# Altium project MCORD_AFE.PrjPCB (part 1 of 2)
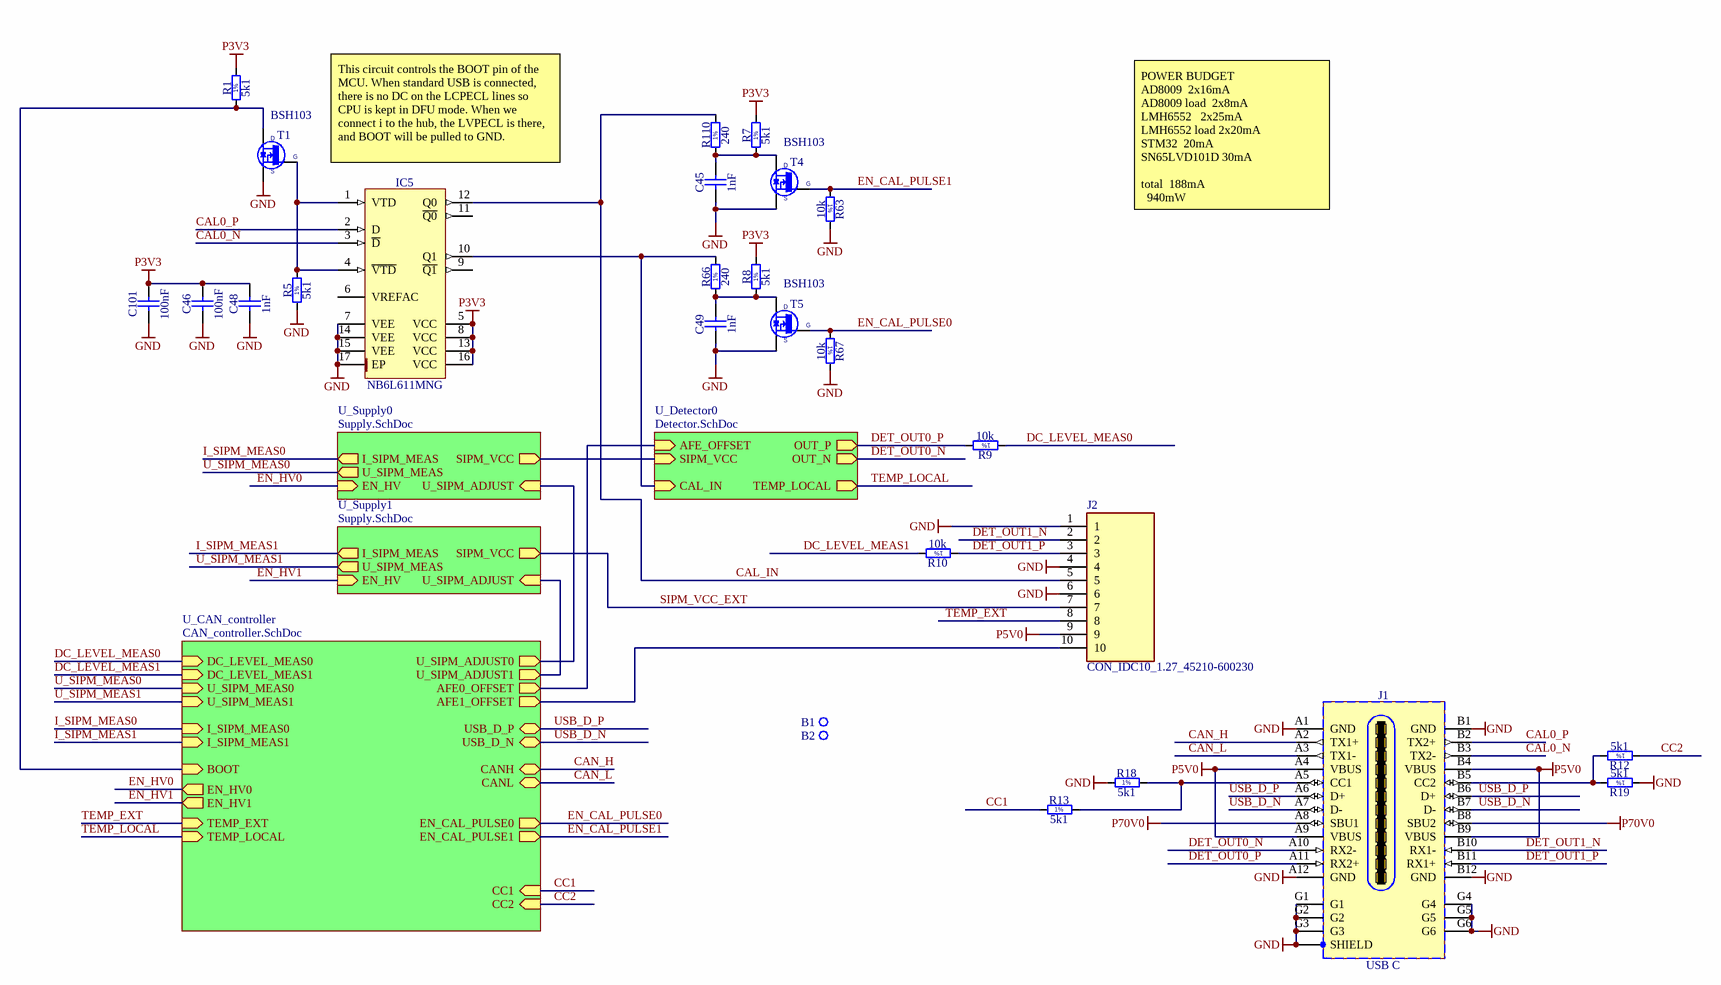
[diagram p0: MCORD_AFE.SchDoc]
4 sheets, 135 parts. Net scope: hierarchical (ports join the sheet entries above them; power ports are global).
Board file: MCORD_AFE.PCBDOC
Sheets:
  MCORD_AFE.SchDoc
    U_CAN_controller = CAN_controller.SchDoc
    U_Detector0 = Detector.SchDoc
    U_Supply0 = Supply.SchDoc
    U_Supply1 = Supply.SchDoc

## Sheet MCORD_AFE.SchDoc: MCORD AFE
size 420 x 297 mm; Author: G.Kasprowicz; CompanyName: WUT ISE; DrawnBy: G.Kasprowicz; Organization: WUT ISE; Address1: PW ISE; Address2: Nowowiejska 15/19 00-665 Warsaw; Address3: gkasprow@gmail.com; DocumentNumber: 1; Revision: 2; SheetNumber: 1; SheetTotal: 4; ModifiedBy: -; CheckedDate: -; Title2: top; DivGrp: WUT ISE; Designer: G.Kasprowicz; ModifiedDate: -; ProjectName: Sensor Box

### Parts
B1  Plated Hole  [MTG320_550]  (value not drawn)  (no BOM)
B2  Plated Hole  [MTG320_550]  (value not drawn)  (no BOM)
C45  1nF  [CAPC1005X55N]
C46  100nF  [CAPC1005X55N]
C48  1nF  [CAPC1005X55N]
C49  1nF  [CAPC1005X55N]
C101  100nF  [CAPC1005X55N]
IC5  NB6L611MNG  [QFN50P300X300X100-17N-S185]
J1  USB C  [AMPHENOL_MUSBRM5C1M0]
J2  CON_IDC10_1.27_45210-600230  [SHDR10W38P127_2X5_1069X594X747P]
R1  5k1  [RESC1005X40N]
R5  5k1  [RESC1005X40N]
R7  5k1  [RESC1005X40N]
R8  5k1  [RESC1005X40N]
R9  10k  [RESC1005X40N]
R10  10k  [RESC1005X40N]
R12  5k1  [RESC1005X40N]
R13  5k1  [RESC1005X40N]
R18  5k1  [RESC1005X40N]
R19  5k1  [RESC1005X40N]
R63  10k  [RESC1005X40N]
R66  240  [RESC1005X40N]
R67  10k  [RESC1005X40N]
R110  240  [RESC1005X40N]
T1  BSH103  [SOT95P230X110-3N]
T4  BSH103  [SOT95P230X110-3N]
T5  BSH103  [SOT95P230X110-3N]

### Sub-sheets
U_CAN_controller = CAN_controller.SchDoc: CANH (bidir), USB_D_P (bidir), CANL (bidir), USB_D_N (bidir), U_SIPM_ADJUST0 (out), U_SIPM_ADJUST1 (out), EN_HV0 (out), EN_HV1 (out), DC_LEVEL_MEAS0 (in), DC_LEVEL_MEAS1 (in), U_SIPM_MEAS0 (in), U_SIPM_MEAS1 (in), I_SIPM_MEAS0 (in), I_SIPM_MEAS1 (in), TEMP_EXT (in), TEMP_LOCAL (in), EN_CAL_PULSE1 (out), EN_CAL_PULSE0 (out), AFE0_OFFSET (out), AFE1_OFFSET (out), BOOT (in), CC2 (in), CC1 (in)
U_Detector0 = Detector.SchDoc: SIPM_VCC (in), OUT_P (out), OUT_N (out), CAL_IN (in), TEMP_LOCAL (out), AFE_OFFSET (in)
U_Supply0 = Supply.SchDoc: SIPM_VCC (out), U_SIPM_MEAS (out), EN_HV (in), I_SIPM_MEAS (out), U_SIPM_ADJUST (in)
U_Supply1 = Supply.SchDoc: SIPM_VCC (out), U_SIPM_MEAS (out), EN_HV (in), I_SIPM_MEAS (out), U_SIPM_ADJUST (in)

### Nets
GND: C45.1 C46.1 C48.1 C49.1 C101.1 IC5.7(VEE) IC5.14(VEE) IC5.15(VEE) IC5.17(EP) J1.A1(GND) J1.A12(GND) J1.B1(GND) J1.B12(GND) J1.G1 J1.G2 J1.G3 J1.G4 J1.G5 J1.G6 J1.SHIELD J2.1 J2.4 J2.6 R5.1 R18.1 R19.1 R63.2 R67.2 T1.2(S) T4.2(S) T5.2(S)
P3V3: C46.2 C48.2 C101.2 IC5.5(VCC) IC5.8(VCC) IC5.13(VCC) IC5.16(VCC) R1.2 R7.2 R8.2
P5V0: J1.A4(VBUS) J1.A9(VBUS) J1.B4(VBUS) J1.B9(VBUS) J2.9
P70V0: J1.A8(SBU1) J1.B8(SBU2)
AFE0_OFFSET: sheet U_CAN_controller/AFE0_OFFSET, sheet U_Detector0/AFE_OFFSET
AFE1_OFFSET: J2.10 ; sheet U_CAN_controller/AFE1_OFFSET
CAL0_N: IC5.3(~{D}) J1.B3(TX2-)
CAL0_P: IC5.2(D) J1.B2(TX2+)
CAL_IN: IC5.12(Q0) J2.5 R110.2
CAN_H: J1.A2(TX1+) ; sheet U_CAN_controller/CANH
CAN_L: J1.A3(TX1-) ; sheet U_CAN_controller/CANL
CC1: R13.1 ; sheet U_CAN_controller/CC1
CC2: R12.1 ; sheet U_CAN_controller/CC2
DC_LEVEL_MEAS0: R9.1 ; sheet U_CAN_controller/DC_LEVEL_MEAS0
DC_LEVEL_MEAS1: R10.2 ; sheet U_CAN_controller/DC_LEVEL_MEAS1
DET_OUT0_N: J1.A10(RX2-) ; sheet U_Detector0/OUT_N
DET_OUT0_P: J1.A11(RX2+) R9.2 ; sheet U_Detector0/OUT_P
DET_OUT1_N: J1.B10(RX1-) J2.2
DET_OUT1_P: J1.B11(RX1+) J2.3 R10.1
EN_CAL_PULSE0: R67.1 T5.1(G) ; sheet U_CAN_controller/EN_CAL_PULSE0
EN_CAL_PULSE1: R63.1 T4.1(G) ; sheet U_CAN_controller/EN_CAL_PULSE1
EN_HV0: sheet U_CAN_controller/EN_HV0, sheet U_Supply0/EN_HV
EN_HV1: sheet U_CAN_controller/EN_HV1, sheet U_Supply1/EN_HV
I_SIPM_MEAS0: sheet U_CAN_controller/I_SIPM_MEAS0, sheet U_Supply0/I_SIPM_MEAS
I_SIPM_MEAS1: sheet U_CAN_controller/I_SIPM_MEAS1, sheet U_Supply1/I_SIPM_MEAS
SIPM_VCC_EXT: J2.7 ; sheet U_Supply1/SIPM_VCC
TEMP_EXT: J2.8 ; sheet U_CAN_controller/TEMP_EXT
TEMP_LOCAL: sheet U_CAN_controller/TEMP_LOCAL, sheet U_Detector0/TEMP_LOCAL
U_SIPM_ADJUST0: sheet U_CAN_controller/U_SIPM_ADJUST0, sheet U_Supply0/U_SIPM_ADJUST
U_SIPM_ADJUST1: sheet U_CAN_controller/U_SIPM_ADJUST1, sheet U_Supply1/U_SIPM_ADJUST
U_SIPM_MEAS0: sheet U_CAN_controller/U_SIPM_MEAS0, sheet U_Supply0/U_SIPM_MEAS
U_SIPM_MEAS1: sheet U_CAN_controller/U_SIPM_MEAS1, sheet U_Supply1/U_SIPM_MEAS
USB_D_N: J1.A7(D-) J1.B7(D-) ; sheet U_CAN_controller/USB_D_N
USB_D_P: J1.A6(D+) J1.B6(D+) ; sheet U_CAN_controller/USB_D_P
NetC45_2: C45.2 R7.1 R110.1 T4.3(D)
NetC49_2: C49.2 R8.1 R66.1 T5.3(D)
NetC99_1: IC5.10(Q1) R66.2 ; sheet U_Detector0/CAL_IN
NetIC5_1: IC5.1(VTD) IC5.4(~{VTD}) R5.2 T1.1(G)
NetJ1_A5: J1.A5(CC1) R13.2 R18.2
NetJ1_B5: J1.B5(CC2) R12.2 R19.2
NetR1_1: R1.1 T1.3(D) ; sheet U_CAN_controller/BOOT
NetR44_2: sheet U_Detector0/SIPM_VCC, sheet U_Supply0/SIPM_VCC

Not connected (* = marked no-connect by the designer): B1 1; B2 1; IC5 6(VREFAC) 9(~{Q1}) 11(~{Q0})

### Notes on the sheet
- This circuit controls the BOOT pin of the MCU. When standard USB is connected, there is no DC on the LCPECL lines so CPU is kept in DFU mode. When we connect i to the hub, the LVPECL is there, and BOOT will be pulled to GND.
- POWER BUDGET
  AD8009		2x16mA
  AD8009 load 	2x8mA
  LMH6552	 	2x25mA
  LMH6552 load	2x20mA
  STM32		20mA
  SN65LVD101D	30mA
  total		188mA
  940mW
- Project/Equipment
- Document
- Designer
- Drawn by
- Check.by
- Copyright WUT ISE 2018.
  This documentation describes Open Hardware and is licensed under the CERN OHL v.1.1. You may redistribute and modify this documentation under the terms of the CERN OHL v.1.1. (http://ohwr.org/CERNOHL). This documentation is distributed WITHOUT ANY EXPRESS OR IMPLIED WARRANTY, INCLUDING OF MERCHANTABILITY, SATISFACTORY QUALITY AND FITNESS FOR A PARTICULAR PURPOSE. Please see the CERN OHL v.1.1 for applicable conditions.
- Contact
- File
- Last Mod.
- Print Date
- Sheet
- Size
- A3
- of
- Rev
- (in symbol R0402_5K1_1%_0.0625W_100PPM) 1%
- (in symbol R0402_10K_1%_0.0625W_100PPM) 1%
- (in symbol R0402_240R_1%_0.0625W_100PPM) 1%

### Library data of the parts
B1 B2 = PLATED_HOLE3.2_PAD5.5: Single Terminal Socket; Part Description: Plated Through Hole: Hole Dia.=3.2mm Pad Dia.=5.5mm; Mounted: No; Part Number: PLATED_HOLE3.2_PAD5.5; Component Type: Standard (No BOM); Pin Count: 1; Family: Plated Hole; Socket: No; SMD: No; Sense: No; Status: None; ComponentHeight: 0mm; HelpURL: Undefined; Author: CERN DEM JMW; CreateDate: 01.10.2012; LatestRevisionDate: 01.10.2012; PackageDescription: Plated Through Hole: Hole Dia.=3.2mm Pad Dia.=5.5mm
C45 C48 C49 = CC0402_1NF_50V_5%_C0G: Non-polarised capacitor; Part Description: SMD Multilayer Chip Ceramic Capacitor; Manufacturer: GENERIC; Manufacturer1 Part Number: C0402C102J5GACTU; Voltage: 50V; TC: C0G/NP0; Tolerance: ±5%; Part Number: CC0402_1NF_50V_5%_C0G; Component Kind: Standard; Component Type: Standard; Pin Count: 2; Value: 1nF; Status: Preferred; Manufacturer Part Number: CC0402_1NF_50V_5%_C0G; Case: 0402; Mounted: Yes; Socket: No; SMD: Yes; Sense: No; Manufacturer1 Example: KEMET; Manufacturer1 ComponentHeight: 0.55mm; HelpURL: \\cern.ch\dfs\Applications\Altium\Datasheets\CC0402_C0G_KEMET_(Commercial Grade).pdf; Author: CERN DEM BC; CreateDate: 02/09/2019; LatestRevisionDate: 02/09/2019
C46 C101 = CC0402_100NF_16V_10%_X7R: Non-polarised capacitor; Part Description: SMD Multilayer Chip Ceramic Capacitor; Manufacturer: GENERIC; Manufacturer1 Part Number: GRM155R71C104KA88D; Voltage: 16V; TC: X7R; Tolerance: ±10%; Part Number: CC0402_100NF_16V_10%_X7R; Component Kind: Standard; Component Type: Standard; Pin Count: 2; Value: 100nF; Status: Not Recommended; Manufacturer Part Number: CC0402_100NF_16V_10%_X7R; Case: 0402; Mounted: Yes; Socket: No; SMD: Yes; Sense: No; HelpURL: \\cern.ch\dfs\Applications\Altium\Datasheets\CC0402_X7R_MURATA_GRM.pdf; Author: CERN DEM JLC; CreateDate: 05.12.2013; LatestRevisionDate: 03.12.2007; Manufacturer1 Example: MURATA; Manufacturer1 ComponentHeight: 0.55mm
IC5 = NB6L611MNG: 2.5V/3.3V 1:2 Differential LVPECL Clock / Data Fanout Buffer; Manufacturer: ON SEMICONDUCTOR; PressFit: No; Bonding: No; Part Number: NB6L611MNG; Component Kind: Standard; Component Type: Standard; Device: NB6L611MNG; PackageDescription: QFN,0.50mm pitch,square; 4 pin X 4 pin, 3mm X 3mm X 1.00mm H body (w/thermal tab 1.85 X 1.85mm),  IPC Medium Density; Part Description: 2.5V/3.3V 1:2 Differential LVPECL Clock / Data Fanout Buffer; Manufacturer Part Number: NB6L611MNG; Pin Count: 17; Case: QFN16; Mounted: Yes; Socket: No; SMD: Yes; Sense: No; ComponentHeight: 1mm; Author: CERN DEM JLC; HelpURL: \\cern.ch\dfs\Applications\Altium\Datasheets\NB6L611MNG.pdf; CreateDate: 21.02.2018; LatestRevisionDate: 21.02.2018
J1 = AMPHENOL_MUSBRM5C1M0: 2x12 Pin + 6G + 1 Shield  USB Type C Receptacle; Part Description: 1 Port Vertical Receptacle 24 Contacts Rugged USB Type C Input Output Connector; PressFit: No; Part Number: AMPHENOL_MUSBRM5C1M0; Component Kind: Standard; Component Type: Standard; Pin Count: 31; Family: USB C; Mounted: Yes; Socket: No; SMD: No; Sense: No; Status: None; Manufacturer: AMPHENOL; Manufacturer Part Number: MUSBRM5C1M0; ComponentHeight: 14.95mm; HelpURL: \\cern.ch\dfs\Applications\Altium\Datasheets\AMPHENOL_MUSBRM5C1M0.pdf; Author: CERN DEM BC; CreateDate: 26/02/2020; LatestRevisionDate: 26/02/2020
J2 = CON_IDC10_1.27_45210-600230: Connector; Manufacturer_Name: 3M; Allied_Number: 70331440; Datasheet Link: http://multimedia.3m.com/mws/media/905148O/3m-shrouded-boardmount-header-452-series-cd2437.pdf; Height: 7.468mm; Manufacturer_Part_Number: 45210-600230; Mouser Part Number: 517-45210-600230; Mouser Price/Stock: https://www.mouser.com/Search/Refine.aspx?Keyword=517-45210-600230; RS Part Number: 8273691; RS Price/Stock: https://uk.rs-online.com/web/p/products/8273691; Allied Price/Stock: https://www.alliedelec.com/3m-45210-600230/70331440/
R1 R5 R7 R8 R12 R13 R18 R19 = R0402_5K1_1%_0.0625W_100PPM: Resistor - 1%; Part Description: General Purpose Thick Film Chip Resistor; Manufacturer: GENERIC; Manufacturer1 Part Number: 232270675102L; TC: ±100ppm/°C; PressFit: No; Part Number: R0402_5K1_1%_0.0625W_100PPM; Component Kind: Standard; Component Type: Standard; Pin Count: 2; Value: 5k1; Status: Not Recommended; Power: 0.0625W; Tolerance: ±1%; Manufacturer Part Number: R0402_5K1_1%_0.0625W_100PPM; Case: 0402; Mounted: Yes; Sense: No; Socket: No; SMD: Yes; Manufacturer1 Example: YAGEO PHYCOMP; Manufacturer1 ComponentHeight: 0.4mm; HelpURL: \\cern.ch\dfs\Applications\Altium\Datasheets\R0402_Phycomp_RC0402.pdf; Author: CERN DEM JLC; CreateDate: 03.12.2007; LatestRevisionDate: 17.10.2012
R9 R10 R63 R67 = R0402_10K_1%_0.0625W_100PPM: Resistor - 1%; Part Description: General Purpose Thick Film Chip Resistor; Manufacturer: GENERIC; Manufacturer1 Part Number: 232270671003L; TC: ±100ppm/°C; PressFit: No; Part Number: R0402_10K_1%_0.0625W_100PPM; Component Kind: Standard; Component Type: Standard; Pin Count: 2; Value: 10k; Status: Not Recommended; Power: 0.0625W; Tolerance: ±1%; Manufacturer Part Number: R0402_10K_1%_0.0625W_100PPM; Case: 0402; Mounted: Yes; Sense: No; Socket: No; SMD: Yes; Manufacturer1 Example: YAGEO PHYCOMP; Manufacturer1 ComponentHeight: 0.4mm; HelpURL: \\cern.ch\dfs\Applications\Altium\Datasheets\R0402_Phycomp_RC0402.pdf; Author: CERN DEM JLC; CreateDate: 03.12.2007; LatestRevisionDate: 17.10.2012
R66 R110 = R0402_240R_1%_0.0625W_100PPM: Resistor - 1%; Part Description: General Purpose Thick Film Chip Resistor; Manufacturer: GENERIC; Manufacturer1 Part Number: 232270672401L; TC: ±100ppm/°C; PressFit: No; Part Number: R0402_240R_1%_0.0625W_100PPM; Component Kind: Standard; Component Type: Standard; Pin Count: 2; Value: 240; Status: Not Recommended; Power: 0.0625W; Tolerance: ±1%; Manufacturer Part Number: R0402_240R_1%_0.0625W_100PPM; Case: 0402; Mounted: Yes; Sense: No; Socket: No; SMD: Yes; Manufacturer1 Example: YAGEO PHYCOMP; Manufacturer1 ComponentHeight: 0.4mm; HelpURL: \\cern.ch\dfs\Applications\Altium\Datasheets\R0402_Phycomp_RC0402.pdf; Author: CERN DEM JLC; CreateDate: 03.12.2007; LatestRevisionDate: 17.10.2012
T1 T4 T5 = BSH103: N-CHANNEL MOSFET WITH DIODE; Part Description: 30V 850mA N-Channel Enhancement Mode Field-Effect Transistor; Manufacturer: NEXPERIA; PressFit: No; Bonding: No; Part Number: BSH103; Component Kind: Standard; Component Type: Standard; Device: BSH103; PackageDescription: SOT23, 3 pin, Pitch 0.95mm - 1.3mm W X 2.9mm L X 1.1mm H, IPC Medium Density; Manufacturer Part Number: BSH103; Pin Count: 3; Case: SOT23-3; Mounted: Yes; Socket: No; SMD: Yes; Sense: No; ComponentHeight: 1.1mm; HelpURL: \\cern.ch\dfs\Applications\Altium\Datasheets\BSH103.pdf; Author: CERN DEM JLC; CreateDate: 16/03/2010; LatestRevisionDate: 20/06/2017

## Sheet CAN_controller.SchDoc: MCORD AFE
size 420 x 297 mm; Author: G.Kasprowicz; CompanyName: WUT ISE; DrawnBy: G.Kasprowicz; Organization: WUT ISE; Address1: PW ISE; Address2: Nowowiejska 15/19 00-665 Warsaw; Address3: gkasprow@gmail.com; DocumentNumber: 3; Revision: 2; SheetNumber: 3; SheetTotal: 4; ModifiedBy: -; CheckedDate: -; Title2: CAN controller; DivGrp: WUT ISE; Designer: G.Kasprowicz; ModifiedDate: -; ProjectName: Sensor Box
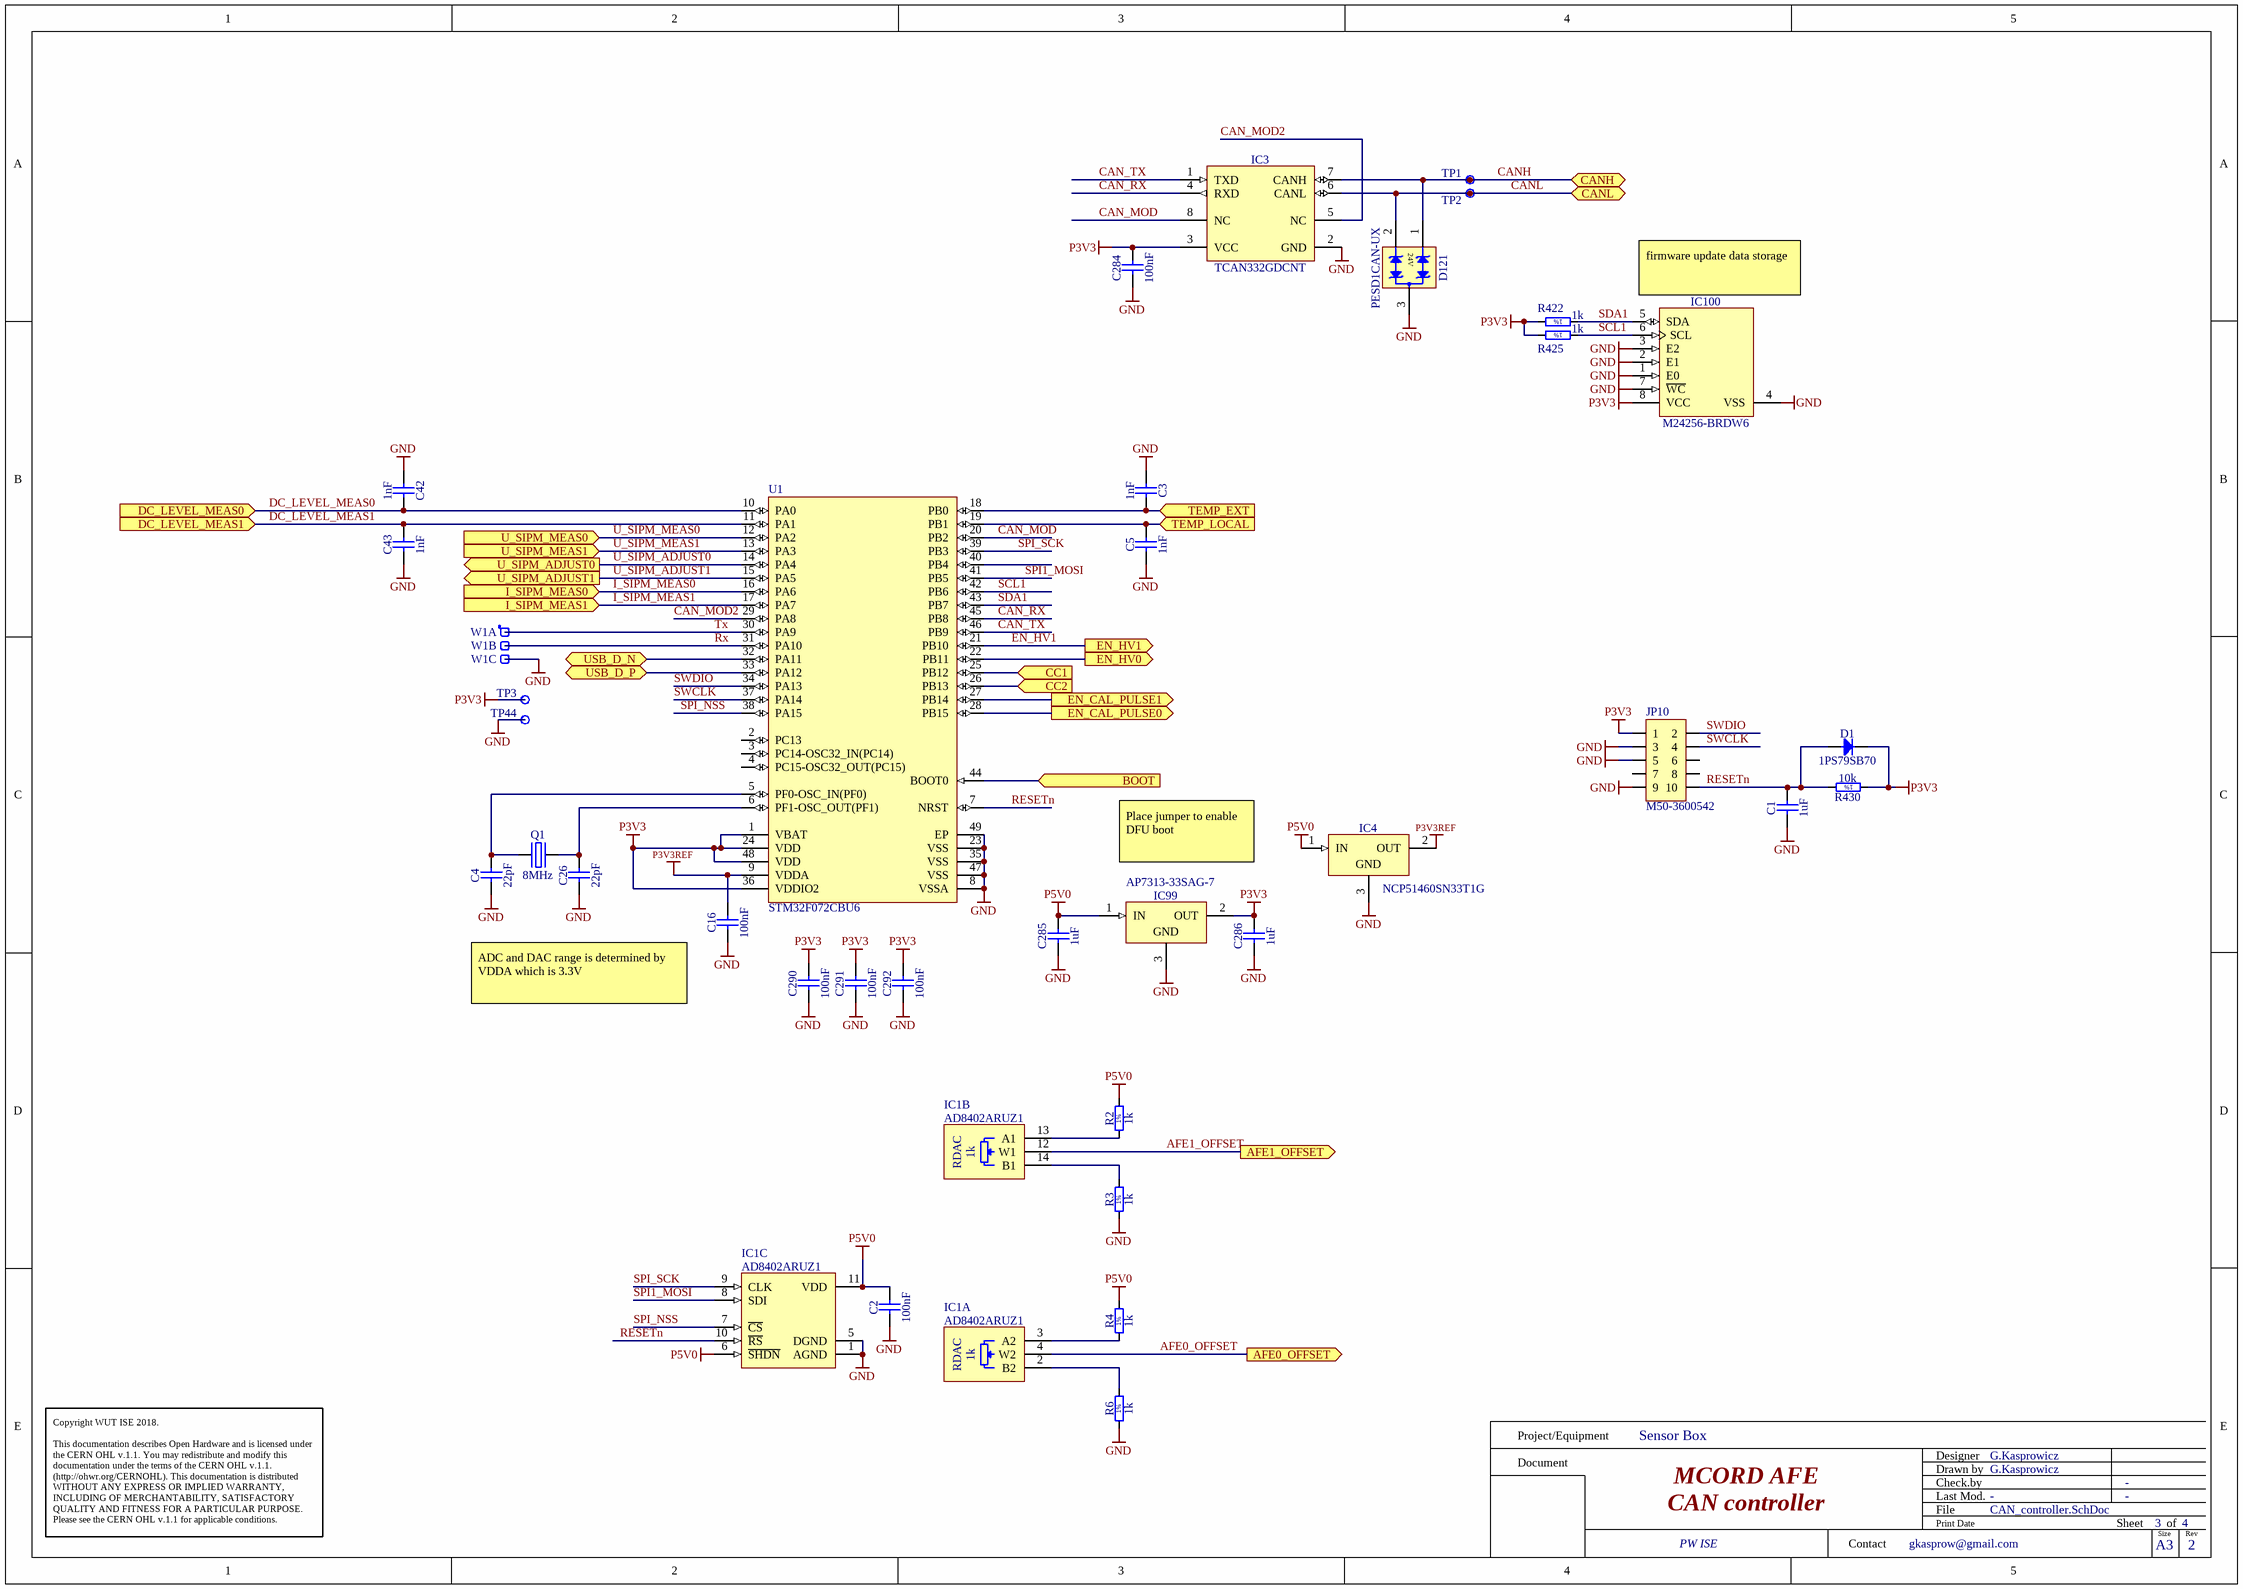
[diagram p1: CAN_controller.SchDoc]

### Parts
C1  1uF  [CAPC1608X87N]
C2  100nF  [CAPC1005X55N]
C3  1nF  [CAPC1005X55N]
C4  22pF  [CAPC1005X55N]
C5  1nF  [CAPC1005X55N]
C16  100nF  [CAPC1005X55N]
C26  22pF  [CAPC1005X55N]
C42  1nF  [CAPC1005X55N]
C43  1nF  [CAPC1005X55N]
C284  100nF  [CAPC1005X55N]
C285  1uF  [CAPC1608X87N]
C286  1uF  [CAPC1608X87N]
C290  100nF  [CAPC1005X55N]
C291  100nF  [CAPC1005X55N]
C292  100nF  [CAPC1005X55N]
D1  1PS79SB70  [SODFL1608X65N]
D121  PESD1CAN-UX  [SOT95P237X112-3N]
IC1  AD8402ARUZ1  [SOP65P640X120-14N]  (parts A,B,C of 3)
IC3  TCAN332GDCNT  [SOT65P280X145-8N]
IC4  NCP51460SN33T1G  [SOT95P240X110-3N]
IC99  AP7313-33SAG-7  [SOT95P240X130-3N]
IC100  M24256-BRDW6  [SOP65P640X120-8N]
JP10  M50-3600542  [PLHTD10S-TR-CV]
Q1  8MHz  [XTAL_TXC_7A]
R2  1k  [RESC1005X40N]
R3  1k  [RESC1005X40N]
R4  1k  [RESC1005X40N]
R6  1k  [RESC1005X40N]
R422  1k  [RESC1005X40N]
R425  1k  [RESC1005X40N]
R430  10k  [RESC1005X40N]
TP1  Test Point  [TPS127]  (value not drawn)
TP2  Test Point  [TPS127]  (value not drawn)
TP3  Test Point  [TPS127]  (value not drawn)
TP44  Test Point  [TPS127]  (value not drawn)
U1  STM32F072CBU6  [STM-UFQFPN48_L]
W1  Header 3  [SAMTEC_HTSW-103-23-L-S]  (value not drawn)  (parts A,B,C of 3)

### Ports
AFE0_OFFSET (out), AFE1_OFFSET (out), BOOT (in), CANH (bidir), CANL (bidir), CC1 (in), CC2 (in), DC_LEVEL_MEAS0 (in), DC_LEVEL_MEAS1 (in), EN_CAL_PULSE0 (out), EN_CAL_PULSE1 (out), EN_HV0 (out), EN_HV1 (out), I_SIPM_MEAS0 (in), I_SIPM_MEAS1 (in), TEMP_EXT (in), TEMP_LOCAL (in), U_SIPM_ADJUST0 (out), U_SIPM_ADJUST1 (out), U_SIPM_MEAS0 (in), U_SIPM_MEAS1 (in), USB_D_N (bidir), USB_D_P (bidir)

### Nets
GND: C1.1 C2.1 C3.1 C4.1 C5.1 C16.1 C26.1 C42.1 C43.1 C284.1 C285.1 C286.1 C290.1 C291.1 C292.1 D121.3(GND) IC1.1(AGND) IC1.5(DGND) IC3.2(GND) IC4.3(GND) IC99.3(GND) IC100.1(E0) IC100.2(E1) IC100.3(E2) IC100.4(VSS) IC100.7(~{WC}) JP10.3 JP10.5 JP10.9 R3.1 R6.1 TP44.1 U1.8(VSSA) U1.23(VSS) U1.35(VSS) U1.47(VSS) U1.49(EP) W1.3
P3V3: C284.2 C286.2 C290.2 C291.2 C292.2 D1.1(C) IC3.3(VCC) IC99.2(OUT) IC100.8(VCC) JP10.1 R422.2 R425.2 R430.1 TP3.1 U1.1(VBAT) U1.24(VDD) U1.36(VDDIO2) U1.48(VDD)
P3V3REF: C16.2 IC4.2(OUT) U1.9(VDDA)
P5V0: C2.2 C285.2 IC1.6(~{SHDN}) IC1.11(VDD) IC4.1(IN) IC99.1(IN) R2.2 R4.2
AFE0_OFFSET: IC1.4(W2) ; port AFE0_OFFSET
AFE1_OFFSET: IC1.12(W1) ; port AFE1_OFFSET
CAN_MOD: IC3.8(NC) U1.20(PB2)
CAN_MOD2: IC3.5(NC) U1.29(PA8)
CAN_RX: IC3.4(RXD) U1.45(PB8)
CAN_TX: IC3.1(TXD) U1.46(PB9)
CANH: D121.1(I/O1) IC3.7(CANH) TP1.1 ; port CANH  [project net CAN_H]
CANL: D121.2(I/O2) IC3.6(CANL) TP2.1 ; port CANL  [project net CAN_L]
CC1: U1.25(PB12) ; port CC1
CC2: U1.26(PB13) ; port CC2
DC_LEVEL_MEAS0: C42.2 U1.10(PA0) ; port DC_LEVEL_MEAS0
DC_LEVEL_MEAS1: C43.2 U1.11(PA1) ; port DC_LEVEL_MEAS1
EN_CAL_PULSE0: U1.28(PB15) ; port EN_CAL_PULSE0
EN_CAL_PULSE1: U1.27(PB14) ; port EN_CAL_PULSE1
EN_HV0: U1.22(PB11) ; port EN_HV0
EN_HV1: U1.21(PB10) ; port EN_HV1
I_SIPM_MEAS0: U1.16(PA6) ; port I_SIPM_MEAS0
I_SIPM_MEAS1: U1.17(PA7) ; port I_SIPM_MEAS1
RESETn: C1.2 D1.2(A) IC1.10(~{RS}) JP10.10 R430.2 U1.7(NRST)
Rx: U1.31(PA10) W1.2
SCL1: IC100.6(SCL) R425.1 U1.42(PB6)
SDA1: IC100.5(SDA) R422.1 U1.43(PB7)
SPI1_MOSI: IC1.8(SDI) U1.41(PB5)
SPI_NSS: IC1.7(~{CS}) U1.38(PA15)
SPI_SCK: IC1.9(CLK) U1.39(PB3)
SWCLK: JP10.4 U1.37(PA14)
SWDIO: JP10.2 U1.34(PA13)
TEMP_EXT: C3.2 U1.18(PB0) ; port TEMP_EXT
TEMP_LOCAL: C5.2 U1.19(PB1) ; port TEMP_LOCAL
Tx: U1.30(PA9) W1.1
U_SIPM_ADJUST0: U1.14(PA4) ; port U_SIPM_ADJUST0
U_SIPM_ADJUST1: U1.15(PA5) ; port U_SIPM_ADJUST1
U_SIPM_MEAS0: U1.12(PA2) ; port U_SIPM_MEAS0
U_SIPM_MEAS1: U1.13(PA3) ; port U_SIPM_MEAS1
USB_D_N: U1.32(PA11) ; port USB_D_N
USB_D_P: U1.33(PA12) ; port USB_D_P
NetC4_2: C4.2 Q1.1(OSC1) U1.5(PF0-OSC_IN(PF0))
NetC26_2: C26.2 Q1.2(OSC2) U1.6(PF1-OSC_OUT(PF1))
NetIC1_2: IC1.2(B2) R6.2
NetIC1_3: IC1.3(A2) R4.1
NetIC1_13: IC1.13(A1) R2.1
NetIC1_14: IC1.14(B1) R3.2
NetR1_1: U1.44(BOOT0) ; port BOOT

Not connected (* = marked no-connect by the designer): JP10 6 7 8; U1 2(PC13) 3(PC14-OSC32_IN(PC14)) 4(PC15-OSC32_OUT(PC15)) 40(PB4)

### Notes on the sheet
- (near IC100) firmware update data storage
- Place jumper to enable DFU boot
- ADC and DAC range is determined by VDDA which is 3.3V
- Project/Equipment
- Document
- Designer
- Drawn by
- Check.by
- Copyright WUT ISE 2018.
  This documentation describes Open Hardware and is licensed under the CERN OHL v.1.1. You may redistribute and modify this documentation under the terms of the CERN OHL v.1.1. (http://ohwr.org/CERNOHL). This documentation is distributed WITHOUT ANY EXPRESS OR IMPLIED WARRANTY, INCLUDING OF MERCHANTABILITY, SATISFACTORY QUALITY AND FITNESS FOR A PARTICULAR PURPOSE. Please see the CERN OHL v.1.1 for applicable conditions.
- Contact
- File
- Last Mod.
- Print Date
- Sheet
- Size
- A3
- of
- Rev
- (in symbol DAC_AD8402ARUZ1, part A) RDAC; 1k
- (in symbol DAC_AD8402ARUZ1, part B) RDAC; 1k
- (in symbol R0402_1K_1%_0.0625W_100PPM) 1%
- (in symbol R0402_10K_1%_0.0625W_100PPM) 1%

### Library data of the parts
C1 C285 C286 = CC0603_1UF_16V_10%_X7R: Non-polarised capacitor; Part Description: SMD Multilayer Chip Ceramic Capacitor; Manufacturer: GENERIC; Manufacturer1 Part Number: 223878615663; Voltage: 16V; TC: X7R; Tolerance: ±10%; Part Number: CC0603_1UF_16V_10%_X7R; Component Kind: Standard; Component Type: Standard; Pin Count: 2; Value: 1uF; Status: None; Manufacturer Part Number: CC0603_1uF_16V_10%_X7R; Case: 0603; Mounted: Yes; Socket: No; SMD: Yes; Sense: No; Manufacturer1 Example: YAGEO PHYCOMP; Manufacturer1 ComponentHeight: 0.9mm; HelpURL: \\cern.ch\dfs\Applications\Altium\Datasheets\CC0603_X7R_PHYCOMP.pdf; Author: CERN DEM JLC; CreateDate: 03.12.2007; LatestRevisionDate: 17.04.2015
C2 C16 C284 C290-C292 = CC0402_100NF_16V_10%_X7R: as C46 on sheet MCORD_AFE; Part Number: CC0402_100NF_16V_10%_X7R; Component Kind: Standard; Component Type: Standard; Pin Count: 2; Value: 100nF; Status: Not Recommended; Manufacturer Part Number: CC0402_100NF_16V_10%_X7R; Case: 0402; Mounted: Yes; Socket: No; SMD: Yes; Sense: No; HelpURL: \\cern.ch\dfs\Applications\Altium\Datasheets\CC0402_X7R_MURATA_GRM.pdf; Author: CERN DEM JLC; CreateDate: 05.12.2013; LatestRevisionDate: 03.12.2007; Manufacturer1 Example: MURATA; Manufacturer1 ComponentHeight: 0.55mm
C3 C5 C42 C43 = CC0402_1NF_50V_5%_C0G: as C45 on sheet MCORD_AFE; Part Number: CC0402_1NF_50V_5%_C0G; Component Kind: Standard; Component Type: Standard; Pin Count: 2; Value: 1nF; Status: Preferred; Manufacturer Part Number: CC0402_1NF_50V_5%_C0G; Case: 0402; Mounted: Yes; Socket: No; SMD: Yes; Sense: No; Manufacturer1 Example: KEMET; Manufacturer1 ComponentHeight: 0.55mm; HelpURL: \\cern.ch\dfs\Applications\Altium\Datasheets\CC0402_C0G_KEMET_(Commercial Grade).pdf; Author: CERN DEM BC; CreateDate: 02/09/2019; LatestRevisionDate: 02/09/2019
C4 C26 = CC0402_22PF_50V_5%_C0G: Non-polarised capacitor; Part Description: SMD Multilayer Chip Ceramic Capacitor; Manufacturer: GENERIC; Manufacturer1 Part Number: C0402C220J5GACTU; Voltage: 50V; TC: C0G/NP0; Tolerance: ±5%; Part Number: CC0402_22PF_50V_5%_C0G; Component Kind: Standard; Component Type: Standard; Pin Count: 2; Value: 22pF; Status: Preferred; Manufacturer Part Number: CC0402_22PF_50V_5%_C0G; Case: 0402; Mounted: Yes; Socket: No; SMD: Yes; Sense: No; Manufacturer1 Example: KEMET; Manufacturer1 ComponentHeight: 0.55mm; HelpURL: \\cern.ch\dfs\Applications\Altium\Datasheets\CC0805_C0G_KEMET_(Commercial Grade).pdf; Author: CERN DEM JLC; CreateDate: 03.12.2007; LatestRevisionDate: 03.12.2007
D1 = D_1PS79SB70: Diode; Part Description: High-speed switching diode; Manufacturer: NEXPERIA; Voltage: 70V; Power: 70mA; PressFit: No; Bonding: No; Part Number: 1PS79SB70; Component Kind: Standard; Component Type: Standard; Device: 1PS79SB70; PackageDescription: Ultra Small Outline Diode Flat Lead (SOD-523), Body; 1.2mm L X 0.8mm W X 0.65mm H, IPC Medium Density; Manufacturer Part Number: 1PS79SB70; Pin Count: 2; Case: SOD523; Mounted: Yes; Socket: No; SMD: Yes; Sense: No; ComponentHeight: 0.65mm; HelpURL: \\cern.ch\dfs\Applications\Altium\Datasheets\BAS516.pdf; Author: GK; CreateDate: 11/09/2018; LatestRevisionDate: 11/09/2018
D121 = D_TVS_PESD1CAN: TVS Diode for CAN; Manufacturer: Nexperia; Voltage: 24V; Power: 400W; PressFit: No; Bonding: No; Part Number: PESD1CAN-UX; Component Kind: Standard; Component Type: Standard; Device: PESD1CAN-UX; PackageDescription: SOT, 0.95mm, pitch; 3 pin,1.30mm W X 2.92mm L X 1.12mm H body, IPC Medium Density; Part Description: TVS Diode for CAN; Manufacturer Part Number: PESD1CAN-UX; Pin Count: 3; Case: SOT-23; Mounted: Yes; Socket: No; SMD: Yes; Sense: No; ComponentHeight: 1.12mm; HelpURL: \\cern.ch\dfs\Applications\Altium\Datasheets\SM712.TCT.pdf; Author: CERN DEM JLC; CreateDate: 03.09.2014; LatestRevisionDate: 13.01.2015
IC1 = DAC_AD8402ARUZ1: 2-Channel 1k Digital Potentiometer; Manufacturer: ANALOG DEVICES; PressFit: No; Bonding: No; Part Number: AD8402ARUZ1; Component Kind: Standard; Component Type: Standard; Device: AD8402ARUZ1; PackageDescription: SOP, 14-Leads, Body 5.1x4.5mm (max), Pitch 0.65mm, IPC Medium Density; Part Description: 2-Channel 1k Digital Potentiometer; Manufacturer Part Number: AD8402ARUZ1; Pin Count: 14; Case: TSSOP14; Mounted: Yes; Socket: No; SMD: Yes; Sense: No; ComponentHeight: 1.75mm; Author: GK; HelpURL: \\cern.ch\dfs\Applications\Altium\Datasheets\AD8402ARZ1.pdf; CreateDate: 09/11/2016; LatestRevisionDate: 09/11/2016
IC3 = TCAN332GDCNT: 3.3V CAN Transceivers with CAN FD (Flexible Data Rate); Manufacturer: TEXAS INSTRUMENTS; PressFit: No; Bonding: No; Part Number: TCAN332GDCNT; Component Kind: Standard; Component Type: Standard; Device: TCAN332GDCNT; PackageDescription: SOT, 0.65mm Pitch; 8 pin, 1.625mm W X 2.90mm L X 1.45mm H body, IPC Medium Density; Part Description: 3.3V CAN Transceivers with CAN FD (Flexible Data Rate); Manufacturer Part Number: TCAN332GDCNT; Pin Count: 8; Case: SOT23-8; Mounted: Yes; Socket: No; SMD: Yes; Sense: No; ComponentHeight: 1.45mm; Author: CERN DEM JLC; HelpURL: \\cern.ch\dfs\Applications\Altium\Datasheets\TCAN332GDCNT.pdf; CreateDate: 22/08/2017; LatestRevisionDate: 22/08/2017
IC4 = NCP51460SN33T1G: 3-Terminal Regulator 1=IN 2=OUT 3=GND; Part Description: 3.3V, 20mA Micropower Precision Voltage Reference; Manufacturer: ON SEMICONDUCTOR; PressFit: No; Bonding: No; Part Number: NCP51460SN33T1G; Component Kind: Standard; Component Type: Standard; Device: NCP51460SN33T1G; PackageDescription: SOT23 3-Leads, Pitch 0.95mm - Body 1.4x3mm, IPC Medium Density; Manufacturer Part Number: NCP51460SN33T1G; Pin Count: 3; Case: SOT23; Mounted: Yes; Socket: No; SMD: Yes; Sense: No; ComponentHeight: 1.1mm; HelpURL: \\cern.ch\dfs\Applications\Altium\Datasheets\NCP51460SN33T1G.pdf; Author: CERN DEM MR; CreateDate: 05.10.2016; LatestRevisionDate: 05.10.2016
IC99 = AP7313-33SAG-7: 3-Terminal Regulator 1=IN 2=OUT 3=GND; Part Description: 3.3V, 150mA Low Quiescent Current, Fast Transient Low Dropout Linear Regulator; Manufacturer: DIODES INCORPORATED; PressFit: No; Bonding: No; Part Number: AP7313-33SAG-7; Component Kind: Standard; Component Type: Standard; Device: AP7313-33SAG-7; PackageDescription: SOT23 3-Leads, Pitch 0.95mm - Body 1.3x2.9mm, IPC Medium Density; Manufacturer Part Number: AP7313-33SAG-7; Pin Count: 3; Case: SOT23; Mounted: Yes; Socket: No; SMD: Yes; Sense: No; ComponentHeight: 1.35mm; HelpURL: \\cern.ch\dfs\Applications\Altium\Datasheets\AP7313-33SAG-7.pdf; Author: CERN DEM JLC; CreateDate: 20.03.2018; LatestRevisionDate: 20.03.2018
IC100 = MEM_M24256-BRDW6P: 256-Kbit Serial I²C Bus EEPROM; Manufacturer: ST MICROELECTRONICS; PressFit: No; Bonding: No; Part Number: M24256-BRDW6P; Component Kind: Standard; Component Type: Standard; Device: M24256-BRDW6; PackageDescription: SOP, 0.65mm pitch; 8 pin, 4.40mm W X 3.00mm L X 1.20mm H body, IPC Medium Density; Part Description: 256-Kbit Serial I²C Bus EEPROM; Manufacturer Part Number: M24256-BRDW6; Pin Count: 8; Case: TSSOP8; Mounted: Yes; Socket: No; SMD: Yes; Sense: No; ComponentHeight: 1.2mm; HelpURL: \\cern.ch\dfs\Applications\Altium\Datasheets\M24256-BRDW6P.pdf; Author: CERN DEM MR; CreateDate: 17.03.2016; LatestRevisionDate: 17.03.2016
JP10 = CON_2x5 1.27 SMT Male: 1.27 mm dual row goldpin (Harwin)
Q1 = XTAL_8MHZ_TXC_7A-8.000MAAE-T: Quartz Crystal; Part Description: Tolerance: ±30ppm, Stability: ±30ppm, -20°C to +70°C, 12pF, SMD Glass Seam Sealing Crystal, 7A Series; Manufacturer: TXC CORPORATION; PressFit: No; Bonding: No; Part Number: XTAL_8MHZ_TXC_7A-8.000MAAE-T; Component Kind: Standard; Component Type: Standard; PackageDescription: 2 Pins, 3.2x5mm, SMD Glass Seam Sealing Crystal, 7A Serie; Value: 8MHz; Manufacturer Part Number: 7A-8.000MAAE-T; Pin Count: 2; Mounted: Yes; Socket: No; SMD: Yes; Sense: No; ComponentHeight: 1.2mm; HelpURL: \\cern.ch\dfs\Applications\Altium\Datasheets\XTAL_TXC_7A.pdf; Author: CERN DEM JLC; CreateDate: 09.10.2014; LatestRevisionDate: 12.11.2014
R2-R4 R6 R422 R425 = R0402_1K_1%_0.0625W_100PPM: Resistor - 1%; Part Description: General Purpose Thick Film Chip Resistor; Manufacturer: GENERIC; Manufacturer1 Part Number: 232270671002L; TC: ±100ppm/°C; PressFit: No; Part Number: R0402_1K_1%_0.0625W_100PPM; Component Kind: Standard; Component Type: Standard; Pin Count: 2; Value: 1k; Status: Not Recommended; Power: 0.0625W; Tolerance: ±1%; Manufacturer Part Number: R0402_1K_1%_0.0625W_100PPM; Case: 0402; Mounted: Yes; Sense: No; Socket: No; SMD: Yes; Manufacturer1 Example: YAGEO PHYCOMP; Manufacturer1 ComponentHeight: 0.4mm; HelpURL: \\cern.ch\dfs\Applications\Altium\Datasheets\R0402_Phycomp_RC0402.pdf; Author: CERN DEM JLC
  R2-R4 R6: CreateDate: 03/12/2007; LatestRevisionDate: 17/10/2012
  R422 R425: CreateDate: 03.12.2007; LatestRevisionDate: 17.10.2012
R430 = R0402_10K_1%_0.0625W_100PPM: as R9 on sheet MCORD_AFE; Part Number: R0402_10K_1%_0.0625W_100PPM; Component Kind: Standard; Component Type: Standard; Pin Count: 2; Value: 10k; Status: Not Recommended; Power: 0.0625W; Tolerance: ±1%; Manufacturer Part Number: R0402_10K_1%_0.0625W_100PPM; Case: 0402; Mounted: Yes; Sense: No; Socket: No; SMD: Yes; Manufacturer1 Example: YAGEO PHYCOMP; Manufacturer1 ComponentHeight: 0.4mm; HelpURL: \\cern.ch\dfs\Applications\Altium\Datasheets\R0402_Phycomp_RC0402.pdf; Author: CERN DEM JLC; CreateDate: 03.12.2007; LatestRevisionDate: 17.10.2012
TP1-TP3 TP44 = SMD_PAD_1.27X1.27MM: Part Description: 1.27mm x 1.27mm PCB Copper Area (SMD Test Point); Mounted: No; Part Number: SMD_PAD_1.27X1.27MM; Component Kind: Standard (No BOM); Component Type: Standard (No BOM); Pin Count: 1; Family: Test Point; Socket: No; SMD: Yes; Sense: No; Status: None; ComponentHeight: 0mm; HelpURL: Undefined; Author: CERN DEM JLC; CreateDate: 12.01.2008; LatestRevisionDate: 12.01.2008; PackageDescription: 1.27mm x 1.27mm PCB Copper Area (SMD Test Point)
U1 = CMP-0304-00173-2: ARM Cortex-M0 32-bit MCU, 128 KB Flash, 16 KB Internal RAM, 37 I/Os, 48-Pin UFQFPN, -40 to 85 degC, Tray; Manufacturer: STMicroelectronics; I/Os (High Current): 37; FLASH Size (Prog) (kB): 128; Supply Voltage(Vcc) min (V): 2; Internal RAM Size (kB): 16; D/A Converter: 1; Operating Frequency(F) (Processor speed) (MHz): 48; Package Reference: UFQFPN48; ComponentLink2Description: Datasheet; ComponentLink2URL: http://www.st.com/st-web-ui/static/active/en/resource/technical/document/datasheet/DM00090510.pdf; Package Description: 48-Pin Ultra Thin Fine Pitch Quad Flat No-Lead, 7 x 7 x 0.6 mm Body, 0.5 mm Pitch, Exposed Pad; Mounting Technology: Surface Mount; Packing: Tray; ComponentLink1URL: http://www.st.com/; ComponentLink1Description: Manufacturer URL; DatasheetVersion: Rev. 5; PartNumber: STM32F072CBU6; Core: ARM Cortex-M0
W1 = SAMTEC_HTSW-103-23-L-S: 3 Mini Wire-Wrap Contact Strip Header; Part Description: 3 Contacts, Pitch 2.54mm, Single Row  Through Mount Straight Header (Post Lead 5.84mm, Tail Lead 2.92mm, Insulator 2.54mm); Manufacturer: SAMTEC; PressFit: No; Status Comment: High Temperature; Part Number: SAMTEC_HTSW-103-23-L-S; Component Kind: Standard; Component Type: Standard; Pin Count: 3; Family: Header 3; Mounted: Yes; Socket: No; SMD: No; Sense: No; Status: Preferred; Manufacturer Part Number: HTSW-103-23-L-S; ComponentHeight: 8.38mm; HelpURL: \\cern.ch\dfs\Applications\Altium\Datasheets\SAMTEC_HTSW-103-23-L-S.pdf; Author: CERN DEM JLC; CreateDate: 22/02/2018; LatestRevisionDate: 22/02/2018

## Sheet Detector.SchDoc: MCORD AFE
size 420 x 297 mm; Author: G.Kasprowicz; CompanyName: WUT ISE; DrawnBy: G.Kasprowicz; Organization: WUT ISE; Address1: PW ISE; Address2: Nowowiejska 15/19 00-665 Warsaw; Address3: gkasprow@gmail.com; DocumentNumber: 2; Revision: 2; SheetNumber: 2; SheetTotal: 4; ModifiedBy: -; CheckedDate: -; Title2: Detector TIA; DivGrp: WUT ISE; Designer: G.Kasprowicz; ModifiedDate: -; ProjectName: Sensor Box
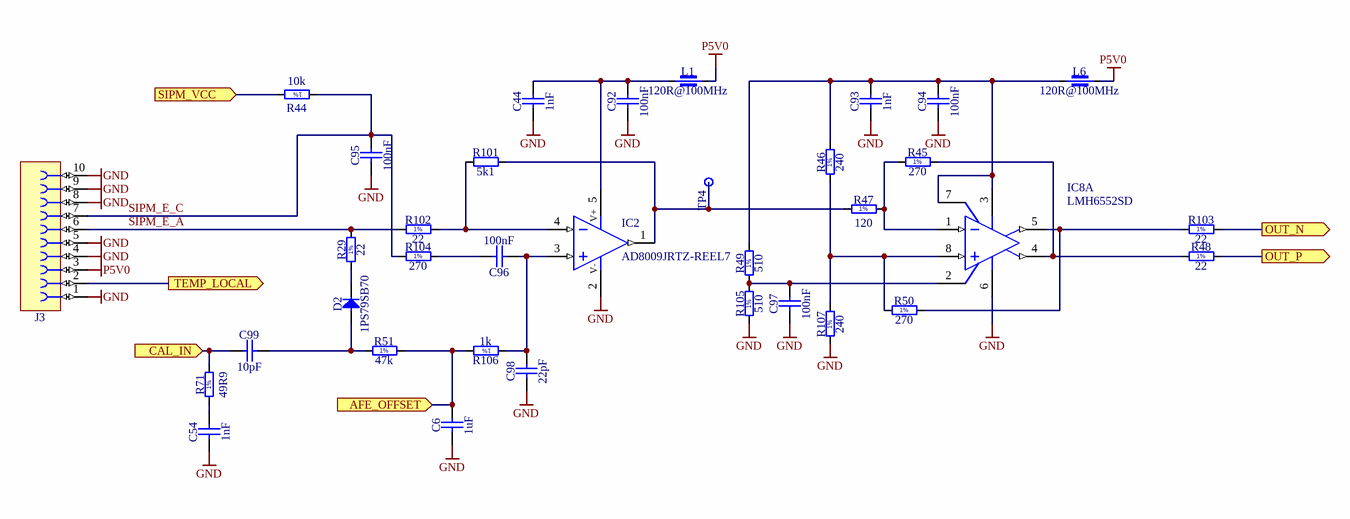
[diagram p2: Detector.SchDoc]

### Parts
C6  1uF  [CAPC1608X87N]
C44  1nF  [CAPC1005X55N]
C54  1nF  [CAPC1005X55N]
C92  100nF  [CAPC1005X55N]
C93  1nF  [CAPC1005X55N]
C94  100nF  [CAPC1005X55N]
C95  100nF  [CAPC1608X90N]
C96  100nF  [CAPC1608X90N]
C97  100nF  [CAPC1005X55N]
C98  22pF  [CAPC1005X55N]
C99  10pF  [CAPC1608X87N]
D2  1PS79SB70  [SODFL1608X65N]
IC2  AD8009JRTZ-REEL7  [SOT95P280X145-5N]
IC8  LMH6552SD  [SDA08C]  (part A of 2)
J3  FFC/FPC  [MOLEX_52745-1097]  (value not drawn)
L1  120R@100MHz  [INDC1005X55N]
L6  120R@100MHz  [INDC1005X55N]
R29  22  [RESC1608X55N]
R44  10k  [RESC1005X40N]
R45  270  [RESC1005X40N]
R46  240  [RESC1005X40N]
R47  120  [RESC1005X40N]
R48  22  [RESC1608X55N]
R49  510  [RESC1005X40N]
R50  270  [RESC1005X40N]
R51  47k  [RESC1005X40N]
R71  49R9  [RESC1005X40N]
R101  5k1  [RESC1005X40N]
R102  22  [RESC1608X55N]
R103  22  [RESC1608X55N]
R104  270  [RESC1005X40N]
R105  510  [RESC1005X40N]
R106  1k  [RESC1005X40N]
R107  240  [RESC1005X40N]
TP4  Test Point  [TPS127]  (value not drawn)

### Ports
AFE_OFFSET (in), CAL_IN (in), OUT_N (out), OUT_P (out), SIPM_VCC (in), TEMP_LOCAL (out)

### Nets
GND: C6.1 C44.1 C54.1 C92.1 C93.1 C94.1 C95.1 C97.1 C98.1 IC2.2(V-) IC8.6(V-) J3.1 J3.4 J3.5 J3.8 J3.9 J3.10 R105.1 R107.1
P5V0: J3.3 L1.2 L6.2
AFE0_OFFSET: C6.2 R51.2 R106.2 ; port AFE_OFFSET
DET_OUT0_N: R103.2 ; port OUT_N
DET_OUT0_P: R48.2 ; port OUT_P
SIPM_E_A: J3.6 R29.2 R102.1
SIPM_E_C: C95.2 J3.7 R44.1 R104.1
TEMP_LOCAL: J3.2 ; port TEMP_LOCAL
NetC44_2: C44.2 C92.2 IC2.5(V+) L1.1
NetC54_2: C54.2 R71.1
NetC93_2: C93.2 C94.2 IC8.3(V+) IC8.7(EN) L6.1 R46.2 R49.2
NetC96_1: C96.1 C98.2 IC2.3(IN+) R106.1
NetC96_2: C96.2 R104.2
NetC97_2: C97.2 IC8.2(VCM) R49.1 R105.2
NetC99_1: C99.1 R71.2 ; port CAL_IN
NetC99_2: C99.2 D2.2(A) R51.1
NetD2_1: D2.1(C) R29.1
NetIC2_1: IC2.1(OUT) R47.1 R101.2 TP4.1
NetIC2_4: IC2.4(IN-) R101.1 R102.2
NetIC8_1: IC8.1(IN-) R45.1 R47.2
NetIC8_4: IC8.4(OUT+) R45.2 R48.1
NetIC8_5: IC8.5(OUT-) R50.2 R103.1
NetIC8_8: IC8.8(IN+) R46.1 R50.1 R107.2
NetR44_2: R44.2 ; port SIPM_VCC

### Notes on the sheet
- Project/Equipment
- Document
- Designer
- Drawn by
- Check.by
- Copyright WUT ISE 2018.
  This documentation describes Open Hardware and is licensed under the CERN OHL v.1.1. You may redistribute and modify this documentation under the terms of the CERN OHL v.1.1. (http://ohwr.org/CERNOHL). This documentation is distributed WITHOUT ANY EXPRESS OR IMPLIED WARRANTY, INCLUDING OF MERCHANTABILITY, SATISFACTORY QUALITY AND FITNESS FOR A PARTICULAR PURPOSE. Please see the CERN OHL v.1.1 for applicable conditions.
- Contact
- File
- Last Mod.
- Print Date
- Sheet
- Size
- A3
- of
- Rev
- (in symbol R0402_1K_1%_0.0625W_100PPM) 1%
- (in symbol R0402_10K_1%_0.0625W_100PPM) 1%
- (in symbol R0402_47K_1%_0.0625W_100PPM) 1%
- (in symbol R0402_49R9_1%_0.0625W_100PPM) 1%
- (in symbol R0402_120R_1%_0.0625W_100PPM) 1%
- (in symbol R0402_240R_1%_0.0625W_100PPM) 1%
- (in symbol R0402_270R_1%_0.0625W_100PPM) 1%
- (in symbol R0402_510R_1%_0.0625W_100PPM) 1%
- (in symbol R0603_22R_1%_0.1W_100PPM) 1%

### Library data of the parts
C6 = CC0603_1UF_16V_10%_X7R: as C1 on sheet CAN_controller; Part Number: CC0603_1UF_16V_10%_X7R; Component Kind: Standard; Component Type: Standard; Pin Count: 2; Value: 1uF; Status: None; Manufacturer Part Number: CC0603_1uF_16V_10%_X7R; Case: 0603; Mounted: Yes; Socket: No; SMD: Yes; Sense: No; Manufacturer1 Example: YAGEO PHYCOMP; Manufacturer1 ComponentHeight: 0.9mm; HelpURL: \\cern.ch\dfs\Applications\Altium\Datasheets\CC0603_X7R_PHYCOMP.pdf; Author: CERN DEM JLC; CreateDate: 03.12.2007; LatestRevisionDate: 17.04.2015
C44 C54 C93 = CC0402_1NF_50V_5%_C0G: as C45 on sheet MCORD_AFE; Part Number: CC0402_1NF_50V_5%_C0G; Component Kind: Standard; Component Type: Standard; Pin Count: 2; Value: 1nF; Status: Preferred; Manufacturer Part Number: CC0402_1NF_50V_5%_C0G; Case: 0402; Mounted: Yes; Socket: No; SMD: Yes; Sense: No; Manufacturer1 Example: KEMET; Manufacturer1 ComponentHeight: 0.55mm; HelpURL: \\cern.ch\dfs\Applications\Altium\Datasheets\CC0402_C0G_KEMET_(Commercial Grade).pdf; Author: CERN DEM BC; CreateDate: 02/09/2019; LatestRevisionDate: 02/09/2019
C92 C94 C97 = CC0402_100NF_16V_10%_X7R: as C46 on sheet MCORD_AFE; Part Number: CC0402_100NF_16V_10%_X7R; Component Kind: Standard; Component Type: Standard; Pin Count: 2; Value: 100nF; Status: Not Recommended; Manufacturer Part Number: CC0402_100NF_16V_10%_X7R; Case: 0402; Mounted: Yes; Socket: No; SMD: Yes; Sense: No; HelpURL: \\cern.ch\dfs\Applications\Altium\Datasheets\CC0402_X7R_MURATA_GRM.pdf; Author: CERN DEM JLC; CreateDate: 05.12.2013; LatestRevisionDate: 03.12.2007; Manufacturer1 Example: MURATA; Manufacturer1 ComponentHeight: 0.55mm
C95 C96 = CC0603_100NF_100V_10%_X7R: Non-polarised capacitor; Part Description: SMD Multilayer Chip Ceramic Capacitor; Manufacturer: GENERIC; Manufacturer1 Part Number: GRM188R72A104KA35D; Voltage: 100V; TC: X7R; Tolerance: ±10%; Part Number: CC0603_100NF_100V_10%_X7R; Component Kind: Standard; Component Type: Standard; Pin Count: 2; Value: 100nF; Status: None; Manufacturer Part Number: CC0603_100NF_100V_10%_X7R; Case: 0603; Mounted: Yes; Socket: No; SMD: Yes; Sense: No; Manufacturer1 Example: MURATA; Manufacturer1 ComponentHeight: 0.9mm; HelpURL: \\cern.ch\dfs\Applications\Altium\Datasheets\CC0603_MURATA_GRM188R72A104KA35D.pdf; Author: CERN DEM JLC; CreateDate: 11.12.2013; LatestRevisionDate: 11.12.2013
C98 = CC0402_22PF_50V_5%_C0G: as C4 on sheet CAN_controller; Part Number: CC0402_22PF_50V_5%_C0G; Component Kind: Standard; Component Type: Standard; Pin Count: 2; Value: 22pF; Status: Preferred; Manufacturer Part Number: CC0402_22PF_50V_5%_C0G; Case: 0402; Mounted: Yes; Socket: No; SMD: Yes; Sense: No; Manufacturer1 Example: KEMET; Manufacturer1 ComponentHeight: 0.55mm; HelpURL: \\cern.ch\dfs\Applications\Altium\Datasheets\CC0805_C0G_KEMET_(Commercial Grade).pdf; Author: CERN DEM JLC; CreateDate: 03.12.2007; LatestRevisionDate: 03.12.2007
C99 = CC0603_10PF_50V_5%_NP0: Non-polarised capacitor; Part Description: SMD Multilayer Chip Ceramic Capacitor; Manufacturer: GENERIC; Manufacturer1 Part Number: 223886715109; Voltage: 50V; TC: C0G/NP0; Tolerance: ±5%; Part Number: CC0603_10PF_50V_5%_NP0; Component Kind: Standard; Component Type: Standard; Pin Count: 2; Value: 10pF; Status: Preferred; Manufacturer Part Number: CC0603_10PF_50V_5%_NP0; Case: 0603; Mounted: Yes; Socket: No; SMD: Yes; Sense: No; Manufacturer1 Example: PHYCOMP; Manufacturer1 ComponentHeight: 0.87mm; HelpURL: \\cern.ch\dfs\Applications\Altium\Datasheets\CC0603_NP0_PHYCOMP.pdf; Author: CERN DEM JLC; CreateDate: 03.12.2007; LatestRevisionDate: 03.12.2007
D2 = D_1PS79SB70: as D1 on sheet CAN_controller; Part Number: 1PS79SB70; Component Kind: Standard; Component Type: Standard; Device: 1PS79SB70; PackageDescription: Ultra Small Outline Diode Flat Lead (SOD-523), Body; 1.2mm L X 0.8mm W X 0.65mm H, IPC Medium Density; Manufacturer Part Number: 1PS79SB70; Pin Count: 2; Case: SOD523; Mounted: Yes; Socket: No; SMD: Yes; Sense: No; ComponentHeight: 0.65mm; HelpURL: \\cern.ch\dfs\Applications\Altium\Datasheets\BAS516.pdf; Author: GK; CreateDate: 11/09/2018; LatestRevisionDate: 11/09/2018
IC2 = AD8009JRTZ-REEL7: Operational Amplifier; Part Description: 1GHz, 5,500 V/us Low Distortion Amplifier; Manufacturer: ANALOG DEVICES; PressFit: No; Bonding: No; Part Number: AD8009JRTZ-REEL7; Component Kind: Standard; Component Type: Standard; Device: AD8009JRTZ-REEL7; PackageDescription: SOT, 0.95mm pitch; 5 pin, 1.60mm W X 2.90mm L X 1.45mm H body, IPC Medium Density; Manufacturer Part Number: AD8009JRTZ-REEL7; Pin Count: 5; Case: SOT23-5; Mounted: Yes; Socket: No; SMD: Yes; Sense: No; ComponentHeight: 1.45mm; Author: CERN DEM JLC; HelpURL: \\cern.ch\dfs\Applications\Altium\Datasheets\AD8009JRTZ-REEL7.pdf; CreateDate: 23/09/2010; LatestRevisionDate: 23/09/2010
IC8 = CMP-0055-00984-1: 1.5 GHz Fully Differential Amplifier, 8-pin LLP; Manufacturer: National Semiconductor; PowerWise: Y; PackageTopMarking: XYTT*6552; CompType: Amplifiers; PackageVersion: revA, Jan-2004; RoHS: Y; PinCount: 8; DatasheetVersion: Sep-2007; PackageReference: SDA08C; PackageDescription: LLP, Plastic, Dual, 2.5 x 3.0 x 0.8mm Body, 8 Lead, 0.5mm Pitch, No Pullback
J3 = MOLEX_52745-1097: Connector 10 Female; Part Description: 10 Contacts, 0.5mm Pitch, Right Angled Surface Mount FFC/FPC Connector, ZIF, Top Contact Style; Manufacturer: MOLEX; PressFit: No; Part Number: MOLEX_52745-1097; Component Kind: Standard; Component Type: Standard; Pin Count: 10; Family: FFC/FPC; Mounted: Yes; Socket: No; SMD: Yes; Sense: No; Status: None; Manufacturer Part Number: 52745-1097; ComponentHeight: 2mm; HelpURL: \\cern.ch\dfs\Applications\Altium\Datasheets\MOLEX_52745-1097.pdf; Author: CERN DEM JLC; CreateDate: 04.11.2014; LatestRevisionDate: 05.12.2014
L1 L6 = IND0402_MURATA_BLM15PX121SN1D: Part Description: SMD EMIFIL Chip Ferrite Bead; Manufacturer: MURATA; Power: 2A; Resistance: 0.055R; Tolerance: ±25%; Part Number: IND0402_MURATA_BLM15PX121SN1D; Component Kind: Standard; Component Type: Standard; Pin Count: 2; Value: 120R@100MHz; Status: None; Manufacturer Part Number: BLM15PX121SN1D; Case: 0402; Mounted: Yes; Socket: No; SMD: Yes; Sense: No; ComponentHeight: 0.55mm; HelpURL: \\cern.ch\dfs\Applications\Altium\Datasheets\IND0402_MURATA_BLM15PX.pdf; Author: CERN DEM JMW; CreateDate: 19.02.2014; LatestRevisionDate: 25.10.2018
R29 R48 R102 R103 = R0603_22R_1%_0.1W_100PPM: Resistor - 1%; Part Description: General Purpose Thick Film Chip Resistor; Manufacturer: GENERIC; Manufacturer1 Part Number: NRC06F22R0TRF; Power: 0.1W; TC: ±100ppm/°C; PressFit: No; Part Number: R0603_22R_1%_0.1W_100PPM; Component Kind: Standard; Component Type: Standard; Pin Count: 2; Value: 22; Status: Preferred; Tolerance: ±1%; Manufacturer Part Number: R0603_22R_1%_0.1W_100PPM; Case: 0603; Mounted: Yes; Sense: No; Socket: No; SMD: Yes; Manufacturer1 Example: NIC COMPONENT; Manufacturer1 ComponentHeight: 0.55mm; HelpURL: \\cern.ch\dfs\Applications\Altium\Datasheets\R0603_NIC_NRC.pdf; Author: CERN DEM JLC; CreateDate: 03.12.2007; LatestRevisionDate: 13.03.2008
R44 = R0402_10K_1%_0.0625W_100PPM: as R9 on sheet MCORD_AFE; Part Number: R0402_10K_1%_0.0625W_100PPM; Component Kind: Standard; Component Type: Standard; Pin Count: 2; Value: 10k; Status: Not Recommended; Power: 0.0625W; Tolerance: ±1%; Manufacturer Part Number: R0402_10K_1%_0.0625W_100PPM; Case: 0402; Mounted: Yes; Sense: No; Socket: No; SMD: Yes; Manufacturer1 Example: YAGEO PHYCOMP; Manufacturer1 ComponentHeight: 0.4mm; HelpURL: \\cern.ch\dfs\Applications\Altium\Datasheets\R0402_Phycomp_RC0402.pdf; Author: CERN DEM JLC; CreateDate: 03.12.2007; LatestRevisionDate: 17.10.2012
R45 R50 R104 = R0402_270R_1%_0.0625W_100PPM: Resistor - 1%; Part Description: General Purpose Thick Film Chip Resistor; Manufacturer: GENERIC; Manufacturer1 Part Number: 232270672701L; TC: ±100ppm/°C; PressFit: No; Part Number: R0402_270R_1%_0.0625W_100PPM; Component Kind: Standard; Component Type: Standard; Pin Count: 2; Value: 270; Status: Not Recommended; Power: 0.0625W; Tolerance: ±1%; Manufacturer Part Number: R0402_270R_1%_0.0625W_100PPM; Case: 0402; Mounted: Yes; Sense: No; Socket: No; SMD: Yes; Manufacturer1 Example: YAGEO PHYCOMP; Manufacturer1 ComponentHeight: 0.4mm; HelpURL: \\cern.ch\dfs\Applications\Altium\Datasheets\R0402_Phycomp_RC0402.pdf; Author: CERN DEM JLC; CreateDate: 03.12.2007; LatestRevisionDate: 17.10.2012
R46 R107 = R0402_240R_1%_0.0625W_100PPM: as R66 on sheet MCORD_AFE; Part Number: R0402_240R_1%_0.0625W_100PPM; Component Kind: Standard; Component Type: Standard; Pin Count: 2; Value: 240; Status: Not Recommended; Power: 0.0625W; Tolerance: ±1%; Manufacturer Part Number: R0402_240R_1%_0.0625W_100PPM; Case: 0402; Mounted: Yes; Sense: No; Socket: No; SMD: Yes; Manufacturer1 Example: YAGEO PHYCOMP; Manufacturer1 ComponentHeight: 0.4mm; HelpURL: \\cern.ch\dfs\Applications\Altium\Datasheets\R0402_Phycomp_RC0402.pdf; Author: CERN DEM JLC; CreateDate: 03.12.2007; LatestRevisionDate: 17.10.2012
R47 = R0402_120R_1%_0.0625W_100PPM: Resistor - 1%; Part Description: General Purpose Thick Film Chip Resistor; Manufacturer: GENERIC; Manufacturer1 Part Number: 232270671201L; TC: ±100ppm/°C; PressFit: No; Part Number: R0402_120R_1%_0.0625W_100PPM; Component Kind: Standard; Component Type: Standard; Pin Count: 2; Value: 120; Status: Not Recommended; Power: 0.0625W; Tolerance: ±1%; Manufacturer Part Number: R0402_120R_1%_0.0625W_100PPM; Case: 0402; Mounted: Yes; Sense: No; Socket: No; SMD: Yes; Manufacturer1 Example: YAGEO PHYCOMP; Manufacturer1 ComponentHeight: 0.4mm; HelpURL: \\cern.ch\dfs\Applications\Altium\Datasheets\R0402_Phycomp_RC0402.pdf; Author: CERN DEM JLC; CreateDate: 03.12.2007; LatestRevisionDate: 17.10.2012
R49 R105 = R0402_510R_1%_0.0625W_100PPM: Resistor - 1%; Part Description: General Purpose Thick Film Chip Resistor; Manufacturer: GENERIC; Manufacturer1 Part Number: 232270675101L; TC: ±100ppm/°C; PressFit: No; Part Number: R0402_510R_1%_0.0625W_100PPM; Component Kind: Standard; Component Type: Standard; Pin Count: 2; Value: 510; Status: Not Recommended; Power: 0.0625W; Tolerance: ±1%; Manufacturer Part Number: R0402_510R_1%_0.0625W_100PPM; Case: 0402; Mounted: Yes; Sense: No; Socket: No; SMD: Yes; Manufacturer1 Example: YAGEO PHYCOMP; Manufacturer1 ComponentHeight: 0.4mm; HelpURL: \\cern.ch\dfs\Applications\Altium\Datasheets\R0402_Phycomp_RC0402.pdf; Author: CERN DEM JLC; CreateDate: 03.12.2007; LatestRevisionDate: 17.10.2012
R51 = R0402_47K_1%_0.0625W_100PPM: Resistor - 1%; Part Description: General Purpose Thick Film Chip Resistor; Manufacturer: GENERIC; Manufacturer1 Part Number: 232270675103L; TC: ±100ppm/°C; PressFit: No; Part Number: R0402_47K_1%_0.0625W_100PPM; Component Kind: Standard; Component Type: Standard; Pin Count: 2; Value: 47k; Status: Not Recommended; Power: 0.0625W; Tolerance: ±1%; Manufacturer Part Number: R0402_47K_1%_0.0625W_100PPM; Case: 0402; Mounted: Yes; Sense: No; Socket: No; SMD: Yes; Manufacturer1 Example: YAGEO PHYCOMP; Manufacturer1 ComponentHeight: 0.4mm; HelpURL: \\cern.ch\dfs\Applications\Altium\Datasheets\R0402_Phycomp_RC0402.pdf; Author: CERN DEM JLC; CreateDate: 03.12.2007; LatestRevisionDate: 17.10.2012
R71 = R0402_49R9_1%_0.0625W_100PPM: Resistor - 1%; Part Description: General Purpose Thick Film Chip Resistor; Manufacturer: GENERIC; Manufacturer1 Part Number: 232270674999L or RC0402FR-0749R9L; TC: ±100ppm/°C; Table: Resistors SMD; Part Number: R0402_49R9_1%_0.0625W_100PPM; Component Kind: Standard; Component Type: Standard; Pin Count: 2; Value: 49R9; Status: Not recommended; Power: 0.0625W; Tolerance: ±1%; Manufacturer Part Number: R0402_49R9_1%_0.0625W_100PPM; Case: 0402; Mounted: Yes; Socket: No; SMD: Yes; Manufacturer1 Example: YAGEO PHYCOMP; Manufacturer1 ComponentHeight: 0.4mm; HelpURL: \\cern.ch\dfs\Applications\Altium\Datasheets\R0402_Phycomp_RC0402.pdf; Author: CERN DEM JLC; CreateDate: 2012-10-24; LatestRevisionDate: 2012-10-24
R101 = R0402_5K1_1%_0.0625W_100PPM: as R1 on sheet MCORD_AFE; Part Number: R0402_5K1_1%_0.0625W_100PPM; Component Kind: Standard; Component Type: Standard; Pin Count: 2; Value: 5k1; Status: Not Recommended; Power: 0.0625W; Tolerance: ±1%; Manufacturer Part Number: R0402_5K1_1%_0.0625W_100PPM; Case: 0402; Mounted: Yes; Sense: No; Socket: No; SMD: Yes; Manufacturer1 Example: YAGEO PHYCOMP; Manufacturer1 ComponentHeight: 0.4mm; HelpURL: \\cern.ch\dfs\Applications\Altium\Datasheets\R0402_Phycomp_RC0402.pdf; Author: CERN DEM JLC; CreateDate: 03.12.2007; LatestRevisionDate: 17.10.2012
R106 = R0402_1K_1%_0.0625W_100PPM: as R2 on sheet CAN_controller; Part Number: R0402_1K_1%_0.0625W_100PPM; Component Kind: Standard; Component Type: Standard; Pin Count: 2; Value: 1k; Status: Not Recommended; Power: 0.0625W; Tolerance: ±1%; Manufacturer Part Number: R0402_1K_1%_0.0625W_100PPM; Case: 0402; Mounted: Yes; Sense: No; Socket: No; SMD: Yes; Manufacturer1 Example: YAGEO PHYCOMP; Manufacturer1 ComponentHeight: 0.4mm; HelpURL: \\cern.ch\dfs\Applications\Altium\Datasheets\R0402_Phycomp_RC0402.pdf; Author: CERN DEM JLC; CreateDate: 03/12/2007; LatestRevisionDate: 17/10/2012
TP4 = SMD_PAD_1.27X1.27MM: as TP1 on sheet CAN_controller; Part Number: SMD_PAD_1.27X1.27MM; Component Kind: Standard (No BOM); Component Type: Standard (No BOM); Pin Count: 1; Family: Test Point; Socket: No; SMD: Yes; Sense: No; Status: None; ComponentHeight: 0mm; HelpURL: Undefined; Author: CERN DEM JLC; CreateDate: 12.01.2008; LatestRevisionDate: 12.01.2008; PackageDescription: 1.27mm x 1.27mm PCB Copper Area (SMD Test Point)